# Altium project E17-12_CC.PrjPcb
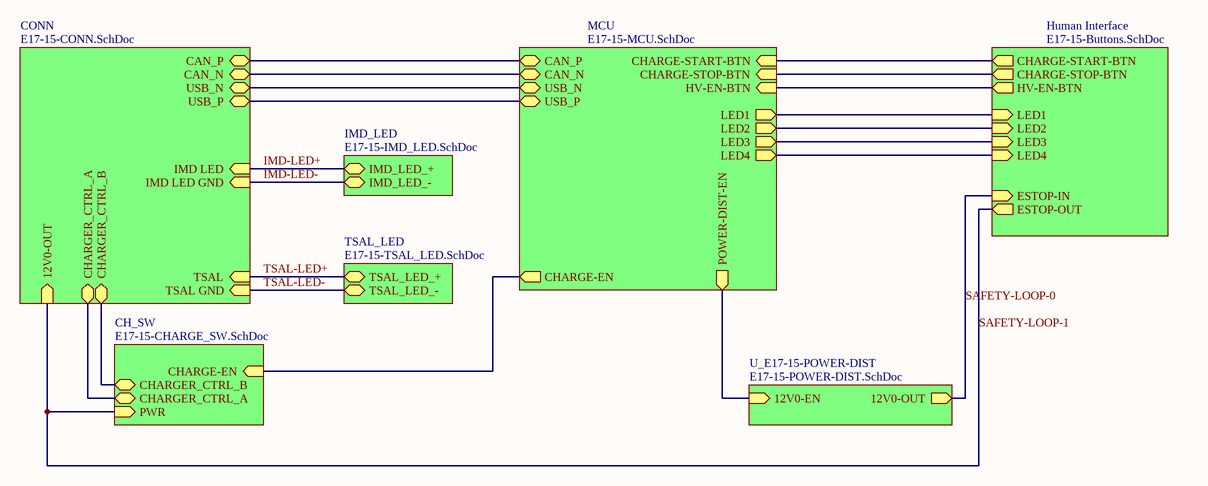
[diagram p0: E17-15-Charge_Cart.SchDoc]
6 sheets, 26 parts. Net scope: hierarchical (ports join the sheet entries above them; power ports are global).
Board file: E17-15-Charge_Cart.PcbDoc
Sheets:
  E17-15-Charge_Cart.SchDoc
    CONN = E17-15-CONN.SchDoc
    CH_SW = E17-15-CHARGE_SW.SchDoc
      SW = E17-04-INDUCTIVE_LOAD_SWITCH.SchDoc
    TSAL_LED = E17-15-TSAL_LED.SchDoc
    IMD_LED = E17-15-IMD_LED.SchDoc

## Sheet E17-15-Charge_Cart.SchDoc
size A; DocumentNumber: 1; SheetNumber: 1; SheetTotal: 9

### Sub-sheets
CH_SW = E17-15-CHARGE_SW.SchDoc: CHARGE-EN (in), CHARGER_CTRL_B (bidir), CHARGER_CTRL_A (bidir), PWR (in)
CONN = E17-15-CONN.SchDoc: IMD LED (in), CAN_P (bidir), CAN_N (bidir), IMD LED GND (in), TSAL GND (in), TSAL (in), CHARGER_CTRL_B (bidir), CHARGER_CTRL_A (bidir), USB_N (bidir), USB_P (bidir), 12V0-OUT (in)
Human Interface = E17-15-Buttons.SchDoc (file not in this document): CHARGE-START-BTN (out), CHARGE-STOP-BTN (out), HV-EN-BTN (out), ESTOP-IN (in), ESTOP-OUT (out), LED1 (in), LED2 (in), LED3 (in), LED4 (in)
IMD_LED = E17-15-IMD_LED.SchDoc: IMD_LED_+ (bidir), IMD_LED_- (bidir)
MCU = E17-15-MCU.SchDoc (file not in this document): CAN_N (bidir), USB_N (bidir), USB_P (bidir), CAN_P (bidir), CHARGE-EN (out), CHARGE-STOP-BTN (in), HV-EN-BTN (in), CHARGE-START-BTN (in), POWER-DIST-EN (out), LED1 (out), LED2 (out), LED3 (out), LED4 (out)
TSAL_LED = E17-15-TSAL_LED.SchDoc: TSAL_LED_- (bidir), TSAL_LED_+ (bidir)
U_E17-15-POWER-DIST = E17-15-POWER-DIST.SchDoc (file not in this document): 12V0-OUT (out), 12V0-EN (in)

### Nets
CAN_N: sheet MCU/CAN_N, sheet CONN/CAN_N
CAN_P: sheet MCU/CAN_P, sheet CONN/CAN_P
IMD-LED+: sheet CONN/IMD LED, sheet IMD_LED/IMD_LED_+
IMD-LED-: sheet CONN/IMD LED GND, sheet IMD_LED/IMD_LED_-
SAFETY-LOOP-0: sheet Human Interface/ESTOP-IN, sheet U_E17-15-POWER-DIST/12V0-OUT
SAFETY-LOOP-1: sheet CONN/12V0-OUT, sheet CH_SW/PWR, sheet Human Interface/ESTOP-OUT
TSAL-LED+: sheet CONN/TSAL, sheet TSAL_LED/TSAL_LED_+
TSAL-LED-: sheet CONN/TSAL GND, sheet TSAL_LED/TSAL_LED_-
USB_N: sheet MCU/USB_N, sheet CONN/USB_N
USB_P: sheet MCU/USB_P, sheet CONN/USB_P
NetCONTROL1_1: sheet MCU/CHARGE-EN, sheet CH_SW/CHARGE-EN
NetJ1_1: sheet CONN/CHARGER_CTRL_A, sheet CH_SW/CHARGER_CTRL_A
NetJ6_10: sheet CONN/CHARGER_CTRL_B, sheet CH_SW/CHARGER_CTRL_B
(unnamed): sheet MCU/CHARGE-STOP-BTN, sheet Human Interface/CHARGE-STOP-BTN
(unnamed): sheet MCU/HV-EN-BTN, sheet Human Interface/HV-EN-BTN
(unnamed): sheet MCU/CHARGE-START-BTN, sheet Human Interface/CHARGE-START-BTN
(unnamed): sheet MCU/POWER-DIST-EN, sheet U_E17-15-POWER-DIST/12V0-EN
(unnamed): sheet MCU/LED1, sheet Human Interface/LED1
(unnamed): sheet MCU/LED2, sheet Human Interface/LED2
(unnamed): sheet MCU/LED3, sheet Human Interface/LED3
(unnamed): sheet MCU/LED4, sheet Human Interface/LED4

## Sheet E17-15-CONN.SchDoc
size A; DocumentNumber: 3; SheetNumber: 3; SheetTotal: 9
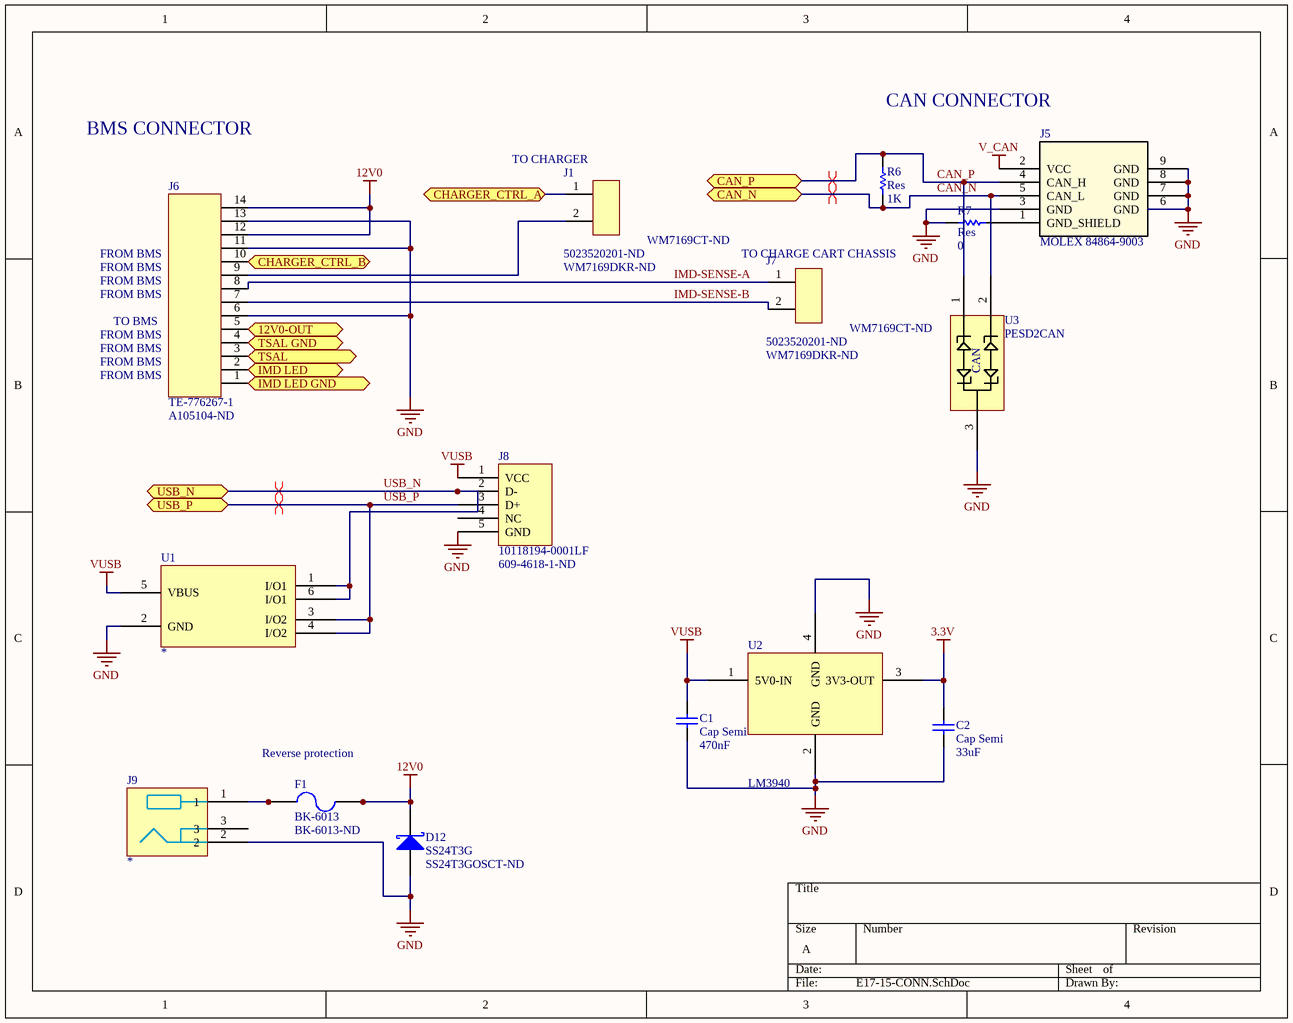
[diagram p1: E17-15-CONN.SchDoc]

### Parts
C1  Cap Semi  value 470nF  [C1206]
C2  Cap Semi  value 33uF  [C1206]
D12  SS24T3G  Supplier Part Number 1: SS24T3GOSCT-ND  [DO-214-AA]
F1  BK-6013  Supplier Part Number 1: BK-6013-ND  [BK-6013]
J1  Supplier Part Number 1: 5023520201-ND  Supplier Part Number 2: WM7169DKR-ND  [MOLEX_DURACLIK_2]  (hidden comment: J_5023520200)
J5  MOLEX 84864-9003  [MOLEX 84864-9003]
J6  TE-776267-1  Supplier Part Number 1: A105104-ND  [TE-776267-1]
J7  Supplier Part Number 1: 5023520201-ND  Supplier Part Number 2: WM7169DKR-ND  [MOLEX_DURACLIK_2]  (hidden comment: J_5023520200)
J8  10118194-0001LF  Supplier Part Number 1: 609-4618-1-ND  [10118194-0001LF]
J9  *  [EJ805A]
R6  Res  value 1K  [2012[0805]]
R7  Res  value 0  [2012[0805]]
U1  *  [SOP6]
U2  LM3940  [TO-263-3]
U3  PESD2CAN  [SOT95P230X110-3N]

### Ports
12V0-OUT (in), CAN_N (bidir), CAN_P (bidir), CHARGER_CTRL_A (bidir), CHARGER_CTRL_B (bidir), IMD LED (in), IMD LED GND (in), TSAL (in), TSAL GND (in), USB_N (bidir), USB_P (bidir)

### Nets
3.3V: C2.2 U2.3(3V3-OUT)
12V0: D12.2(K) F1.3 F1.4 J6.12 J6.14
GND: C1.1 C2.1 D12.1(A) J5.3(GND) J5.6(GND) J5.7(GND) J5.8(GND) J5.9(GND) J6.6 J6.11 J6.13 J8.5(GND) J9.2 R7.1 U1.2(GND) U2.2(GND) U2.4(GND) U3.3(COM)
V_CAN: J5.2(VCC)
VUSB: C1.2 J8.1(VCC) U1.5(VBUS) U2.1(5V0-IN)
CAN_N: J5.5(CAN_L) R6.1 U3.2(CATH2) ; port CAN_N
CAN_P: J5.4(CAN_H) R6.2 U3.1(CATH1) ; port CAN_P
IMD-LED+: J6.2 ; port IMD LED
IMD-LED-: J6.1 ; port IMD LED GND
IMD-SENSE-A: J6.8 J7.1
IMD-SENSE-B: J6.7 J7.2
SAFETY-LOOP-1: J6.5 ; port 12V0-OUT
TSAL-LED+: J6.3 ; port TSAL
TSAL-LED-: J6.4 ; port TSAL GND
USB_N: J8.2(D-) U1.1(I/O1) U1.6(I/O1) ; port USB_N
USB_P: J8.3(D+) U1.3(I/O2) U1.4(I/O2) ; port USB_P
NetF1_1: F1.1 F1.2 J9.1
NetJ1_1: J1.1 ; port CHARGER_CTRL_A
NetJ1_2: J1.2 J6.9
NetJ5_1: J5.1(GND_SHIELD) R7.2
NetJ6_10: J6.10 ; port CHARGER_CTRL_B

Not connected (* = marked no-connect by the designer): J8 4(NC); J9 3

### Layout directives
differential pair: CAN_N, CAN_P, USB_N, USB_P

### Notes on the sheet
- BMS CONNECTOR
- (near J1) TO CHARGER
- CAN CONNECTOR
- FROM BMS
- (near J7) TO CHARGE CART CHASSIS
- TO BMS
- (near F1) Reverse protection
- (in symbol PESD2CAN) CAN

### Library data of the parts
C1 C2 = Cap Semi: Capacitor (Semiconductor SIM Model); Published: 8-Jun-2000; LatestRevisionDate: 29-May-2009; LatestRevisionNote: IPC-7351 Footprint Added.; PackageReference: C1206; Publisher: Altium Limited; PackageDescription: Chip Capacitor
D12 = SS24T3G: Schottky Diode; Published: 8-Jun-2000; LatestRevisionDate: 17-Jul-2002; LatestRevisionNote: Re-released for DXP Platform.; PackageReference: SMB; Publisher: Altium Limited; Code_JEDEC: DO-214-AA; Supplier 1: Digi-Key
F1 = BK-6013: FUSE HOLDER BLADE PCB; Supplier 1: Digi-Key
J1 J7 = J_5023520200: MOLEX DURACLIK 2-PIN RA; Digikey_PN: WM7169CT-ND; Supplier 1: Digi-Key; Supplier 2: Digi-Key
J5 = MOLEX 84864-9003: CAN Micro-Change M12, Right Angle, Male
J6 = TE-776267-1: CONN HEADER 14POS R/A TIN BLK; Supplier 1: Digi-Key
J8 = 10118194-0001LF: CONN USB MICRO B RECPT SMT R/A; Supplier 1: Digi-Key
J9 = EJ508A: CONN PWR JACK 2.1X5.5MM SOLDER
R6 R7 = Res: Surface Mount Resistor; Published: 8-Jun-2000; LatestRevisionDate: 17-Jul-2002; LatestRevisionNote: Re-released for DXP Platform.; PackageReference: AXIAL-0.5; Publisher: Altium Limited
U1 = USBL6-2

## Sheet E17-15-CHARGE_SW.SchDoc
size A; DocumentNumber: 4; SheetNumber: 4; SheetTotal: 9
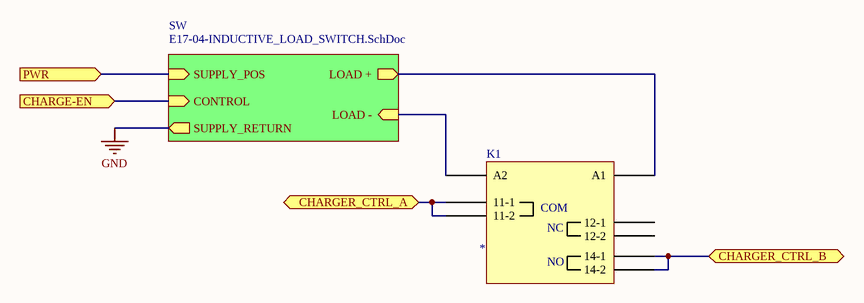
[diagram p2: E17-15-CHARGE_SW.SchDoc]

### Parts
K1  *  [TE-7-1393243-5]

### Sub-sheets
SW = E17-04-INDUCTIVE_LOAD_SWITCH.SchDoc: CONTROL (in), LOAD + (out), SUPPLY_POS (in), LOAD - (in), SUPPLY_RETURN (out)

### Ports
CHARGE-EN (in), CHARGER_CTRL_A (bidir), CHARGER_CTRL_B (bidir), PWR (in)

### Nets
SAFETY-LOOP-1: K1.8(A1) ; port PWR, sheet SW/LOAD +, sheet SW/SUPPLY_POS
NetCONTROL1_1: port CHARGE-EN, sheet SW/CONTROL
NetD2_1: K1.1(A2) ; sheet SW/LOAD -
NetJ1_1: K1.3(11-1) K1.6(11-2) ; port CHARGER_CTRL_A
NetJ6_10: K1.4(14-1) K1.5(14-2) ; port CHARGER_CTRL_B

Not connected (* = marked no-connect by the designer): K1 2(12-1) 7(12-2)

### Notes on the sheet
- (in symbol TE-1393240-3) COM; NC; NO

### Library data of the parts
K1 = TE-1393240-3: RELAY GEN PURPOSE SPDT 16A 110V

## Sheet E17-04-INDUCTIVE_LOAD_SWITCH.SchDoc
size A; DocumentNumber: 7; SheetNumber: 7; SheetTotal: 9
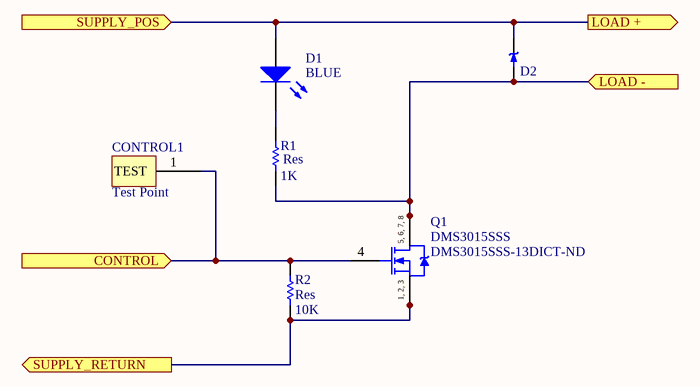
[diagram p3: E17-04-INDUCTIVE_LOAD_SWITCH.SchDoc]

### Parts
CONTROL1  Test Point  [TEST POINT 5000K]
D1  Colour: BLUE  [OVS5MBBCR4]  (hidden comment: OVS5MBBCR4)
D2  PMEG4010ET  [SOT23-3]  (value not drawn)
Q1  DMS3015SSS  Supplier Part Number 1: DMS3015SSS-13DICT-ND  [SOIC-8-150]
R1  Res  value 1K  [2012[0805]]
R2  Res  value 10K  [2012[0805]]

### Ports
CONTROL (in), LOAD + (out), LOAD - (in), SUPPLY_POS (in), SUPPLY_RETURN (out)

### Nets
GND: Q1.1(S) Q1.2(S) Q1.3(S) R2.1 ; port SUPPLY_RETURN
SAFETY-LOOP-1: D1.1(A) D2.3 ; port SUPPLY_POS, port LOAD +
NetCONTROL1_1: CONTROL1.1(TEST) Q1.4(G) R2.2 ; port CONTROL
NetD1_2: D1.2(K) R1.2
NetD2_1: D2.1 Q1.5(D) Q1.6(D) Q1.7(D) Q1.8(D) R1.1 ; port LOAD -

### Notes on the sheet
- (in symbol DMS3015SSS) 5, 6, 7, 8; 1, 2, 3

### Library data of the parts
CONTROL1 = Test Point: 5000-5004, 5015-5019 Keystone Electronics
D1 = OVS5MBBCR4: Typical BLUE LED; Published: 8-Jun-2000; LatestRevisionDate: 17-Jul-2002; LatestRevisionNote: Re-released for DXP Platform.; PackageDocument: Feb-2002; PackageReference: 3.2X1.6X1.1; Publisher: Altium Limited; Supplier 1: Digi-Key; Supplier Part Number 1: 365-1544-1-ND
D2 = PMEG4010ET: SCHOTTKY RECT 40V 1A SOT-23; Supplier 1: Digi-Key; Supplier Part Number 1: 568-4103-6-ND
Q1 = DMS3015SSS: N-Channel Power MOSFET; Supplier 1: Digi-Key
R1 R2 = Res: Surface Mount Resistor; Published: 8-Jun-2000; LatestRevisionDate: 17-Jul-2002; LatestRevisionNote: Re-released for DXP Platform.; PackageReference: AXIAL-0.5; Publisher: Altium Limited

## Sheet E17-15-TSAL_LED.SchDoc
size A; DocumentNumber: 8; SheetNumber: 8; SheetTotal: 9
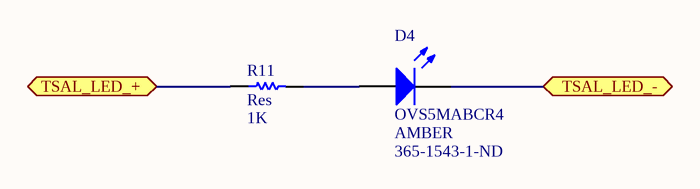
[diagram p4: E17-15-TSAL_LED.SchDoc]

### Parts
D4  OVS5MABCR4  Colour: AMBER  Supplier Part Number 1: 365-1543-1-ND  [OVS5MABCR4]
R11  Res  value 1K  [3216[1206]]

### Ports
TSAL_LED_+ (bidir), TSAL_LED_- (bidir)

### Nets
TSAL-LED+: R11.1 ; port TSAL_LED_+
TSAL-LED-: D4.2(K) ; port TSAL_LED_-
NetD4_1: D4.1(A) R11.2

### Library data of the parts
D4 = OVS5MABCR4: Typical AMBER LED; Published: 8-Jun-2000; LatestRevisionDate: 17-Jul-2002; LatestRevisionNote: Re-released for DXP Platform.; PackageDocument: Feb-2002; PackageReference: 3.2X1.6X1.1; Publisher: Altium Limited; Supplier 1: Digi-Key
R11 = Res: Surface Mount Resistor; Published: 8-Jun-2000; LatestRevisionDate: 17-Jul-2002; LatestRevisionNote: Re-released for DXP Platform.; PackageReference: AXIAL-0.5; Publisher: Altium Limited

## Sheet E17-15-IMD_LED.SchDoc
size A; DocumentNumber: 9; SheetNumber: 9; SheetTotal: 9
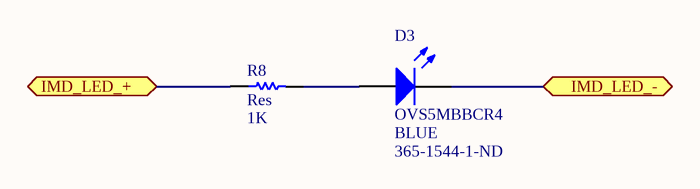
[diagram p5: E17-15-IMD_LED.SchDoc]

### Parts
D3  OVS5MBBCR4  Colour: BLUE  Supplier Part Number 1: 365-1544-1-ND  [OVS5MBBCR4]
R8  Res  value 1K  [3216[1206]]

### Ports
IMD_LED_+ (bidir), IMD_LED_- (bidir)

### Nets
IMD-LED+: R8.1 ; port IMD_LED_+
IMD-LED-: D3.2(K) ; port IMD_LED_-
NetD3_1: D3.1(A) R8.2

### Library data of the parts
D3 = OVS5MBBCR4: Typical BLUE LED; Published: 8-Jun-2000; LatestRevisionDate: 17-Jul-2002; LatestRevisionNote: Re-released for DXP Platform.; PackageDocument: Feb-2002; PackageReference: 3.2X1.6X1.1; Publisher: Altium Limited; Supplier 1: Digi-Key
R8 = Res: Surface Mount Resistor; Published: 8-Jun-2000; LatestRevisionDate: 17-Jul-2002; LatestRevisionNote: Re-released for DXP Platform.; PackageReference: AXIAL-0.5; Publisher: Altium Limited

## Nets that join several sheets
GND: E17-15-CONN (18 pins), E17-04-INDUCTIVE_LOAD_SWITCH (Q1.1 Q1.2 Q1.3 R2.1)
IMD-LED+: E17-15-CONN (J6.2), E17-15-IMD_LED (R8.1)
IMD-LED-: E17-15-CONN (J6.1), E17-15-IMD_LED (D3.2)
NetD2_1: E17-15-CHARGE_SW (K1.1), E17-04-INDUCTIVE_LOAD_SWITCH (6 pins)
NetJ1_1: E17-15-CONN (J1.1), E17-15-CHARGE_SW (K1.3 K1.6)
NetJ6_10: E17-15-CONN (J6.10), E17-15-CHARGE_SW (K1.4 K1.5)
SAFETY-LOOP-1: E17-15-CONN (J6.5), E17-15-CHARGE_SW (K1.8), E17-04-INDUCTIVE_LOAD_SWITCH (D1.1 D2.3)
TSAL-LED+: E17-15-CONN (J6.3), E17-15-TSAL_LED (R11.1)
TSAL-LED-: E17-15-CONN (J6.4), E17-15-TSAL_LED (D4.2)